# Altium schematic sheet FLASH.SchDoc
size A4; SheetNumber: 11; SheetTotal: 14
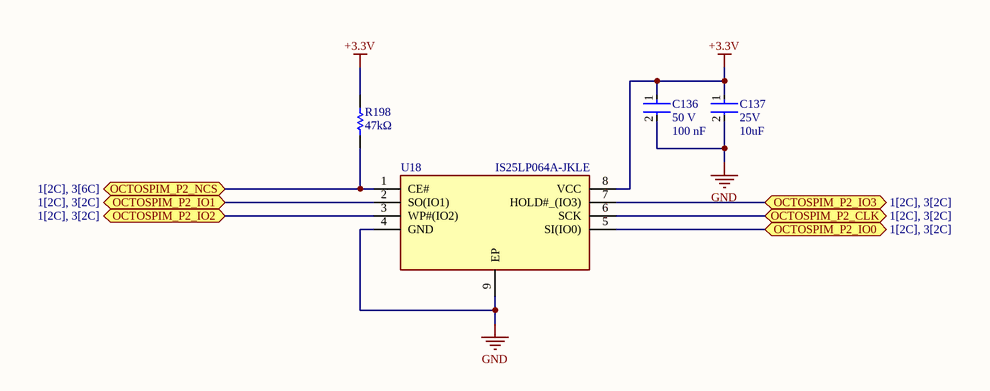
[diagram p0: FLASH.SchDoc]

## Parts
C136  value 100 nF  Voltage Rating: 50 V  [FP-C0603C-CF-IPC_B]  (hidden comment: C0603C104M5RACTU)
C137  Voltage Rating: 25V  Capacitance: 10uF  [FP-C1608-080-IPC_B]  (hidden comment: C1608X5R1E106M080AC)
R198  Resistance: 47kΩ  [RESC1608X55X25ML10T15]  (hidden comment: RC0603FR-1347KL)
U18  IS25LP064A-JKLE  [SON127P600X500X80-9N-D]

## Ports
OCTOSPIM_P2_CLK (bidir, see 1[2C], 3[2C]), OCTOSPIM_P2_IO0 (bidir, see 1[2C], 3[2C]), OCTOSPIM_P2_IO1 (bidir, see 1[2C], 3[2C]), OCTOSPIM_P2_IO2 (bidir, see 1[2C], 3[2C]), OCTOSPIM_P2_IO3 (bidir, see 1[2C], 3[2C]), OCTOSPIM_P2_NCS (bidir, see 1[2C], 3[6C])

## Nets
+3.3V: C136.1 C137.1 R198.2 U18.8(VCC)
GND: C136.2 C137.2 U18.4(GND) U18.9(EP)
OCTOSPIM_P2_CLK: U18.6(SCK) ; port OCTOSPIM_P2_CLK
OCTOSPIM_P2_IO0: U18.5(SI(IO0)) ; port OCTOSPIM_P2_IO0
OCTOSPIM_P2_IO1: U18.2(SO(IO1)) ; port OCTOSPIM_P2_IO1
OCTOSPIM_P2_IO2: U18.3(WP#(IO2)) ; port OCTOSPIM_P2_IO2
OCTOSPIM_P2_IO3: U18.7(HOLD#_(IO3)) ; port OCTOSPIM_P2_IO3
OCTOSPIM_P2_NCS: R198.1 U18.1(CE#) ; port OCTOSPIM_P2_NCS

## Library data of the parts
C136 = CMP-2006-03068-2: CAP CER 0.1UF 50V 20% X7R 0603; Manufacturer: KEMET; Material: Ceramic; Tolerance: 0.2; Temperature Coefficient: 30ppm/°C; Automotive Grade: Grade 1; Capacitance: 0.10 μF; Temperature Range High: +125°C; Device Class L3: Ceramic Capacitors; Manufacturer Part Number: C0603C104M5RACTU; Height: 0.87mm; Category: Cap; RoHS: TRUE; Digikey Description: CAP CER 0.1UF 50V 20% X7R 0603; ComponentLink2URL: https://api.kemet.com/component-edge/download/datasheet/C0603C100J5GACAUTO.pdf; Lead Free: Yes; Temperature Range Low: -55°C; Device Class L1: Passive Components; ComponentLink2Description: Datasheet; Temperature Characteristic: X7R; Automotive: Yes; Temperature: -55°C to +125°C; Octopart: https://octopart.com/c0603c104m5ractu-kemet-11855687; Device Class L2: Capacitors; Package: C0603C-CF; Mouser Description: Multilayer Ceramic Capacitors MLCC - SMD/SMT 50volts 0.1uF X7R 20%
C137 = CMP-2000-05442-2: CAP CER 10UF 25V X5R 0603; Dielectric Material: Ceramic; Tolerance: 20%; Dielectric: X5R; Length: 1.6mm; Termination: SMD/SMT; Depth: 0.8mm; RoHS Compliant: Yes; Construction: Flat; Weight: 7.1E-05oz; Thickness: 0.039inch; Packaging: Tape and Reel; Min Operating Temperature: -55°C; Case Code (Imperial): 0603; Case/Package: 0603; Height: 0.8mm; Case Code (Metric): 1608; Resistor Type: Ceramic; Voltage Rating (DC): 25V; Max Operating Temperature: 85°C; REACH SVHC: No SVHC; Lead Free: Lead Free; Series: C; Width: 0.8mm; Mount: Surface Mount; Package Quantity: 1
R198 = CMP-2000-04221-1: Manufacturer: Yageo; Part Number: RC0603FR-1347KL
U18 = IS25LP064A-JKLE: Integrated Circuit; Manufacturer_Name: Integrated Silicon Solution Inc.; Datasheet Link: http://www.issi.com/WW/pdf/25LP032-64A-B.pdf; Height: 0.8mm; Manufacturer_Part_Number: IS25LP064A-JKLE; Mouser Part Number: N/A; Mouser Price/Stock: https://www.mouser.com/Search/Refine.aspx?Keyword=N%2FA; Arrow Part Number: IS25LP064A-JKLE; Arrow Price/Stock: https://www.arrow.com/en/products/is25lp064a-jkle/integrated-silicon-solution-inc?region=nac; Supplier 1: Digikey; Supplier Part Number 1: 706-1595-ND